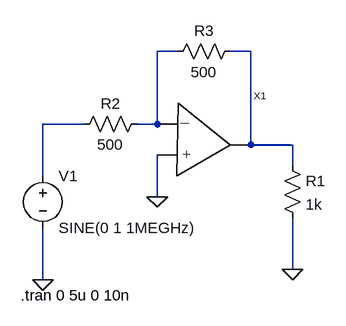
[diagram p0: schematic Inverting_Amplifier_V3.asc]
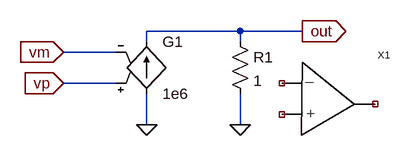
[diagram p1: sub-circuit opamp.asc]
Inverting_Amplifier_V3.asc, the LTspice schematic file:
Version 4
SHEET 1 880 680
WIRE 192 0 160 0
WIRE 304 0 272 0
WIRE 48 112 -16 112
WIRE 160 112 160 0
WIRE 160 112 128 112
WIRE 304 144 304 0
WIRE 368 144 304 144
WIRE 368 176 368 144
WIRE -16 192 -16 112
WIRE 160 224 160 160
WIRE 368 336 368 256
WIRE -16 352 -16 272
FLAG 368 336 0
FLAG 160 224 0
FLAG -16 352 0
SYMBOL opamp 192 144 R0
SYMATTR InstName X1
SYMBOL res 352 160 R0
SYMATTR InstName R1
SYMATTR Value 1k
SYMBOL voltage -16 176 R0
WINDOW 123 0 0 Left 0
WINDOW 39 0 0 Left 0
SYMATTR InstName V1
SYMATTR Value SINE(0 1 1MEGHz)
SYMBOL res 144 96 R90
WINDOW 0 0 56 VBottom 2
WINDOW 3 32 56 VTop 2
SYMATTR InstName R2
SYMATTR Value 500
SYMBOL res 288 -16 R90
WINDOW 0 0 56 VBottom 2
WINDOW 3 32 56 VTop 2
SYMATTR InstName R3
SYMATTR Value 500
TEXT -50 376 Left 2 !.tran 0 5u 0 10n

opamp.asc, the sub-circuit schematic file:
Version 4
SHEET 1 880 680
WIRE 336 112 192 112
WIRE 432 112 336 112
WIRE 192 128 192 112
WIRE 336 128 336 112
WIRE 144 144 64 144
WIRE 144 192 64 192
WIRE 192 256 192 208
WIRE 336 256 336 208
FLAG 192 256 0
FLAG 336 256 0
FLAG 64 144 vm
IOPIN 64 144 In
FLAG 64 192 vp
IOPIN 64 192 In
FLAG 432 112 out
IOPIN 432 112 Out
SYMBOL g2 192 112 R0
SYMATTR InstName G1
SYMATTR Value 1e6
SYMBOL res 320 112 R0
SYMATTR InstName R1
SYMATTR Value 1
SYMBOL opamp 432 224 R0
SYMATTR InstName X1

The netlist it stands for:
* Inverting_Amplifier_V3.asc
XX1 N001 0 N002 opamp
R1 N002 0 1k
V1 N003 0 SINE(0 1 1MEGHz)
R2 N001 N003 500
R3 N002 N001 500

* block symbol definitions
.subckt opamp vm vp out
G1 0 out vp vm 1e6
R1 out 0 1
XX1 NC_01 NC_02 NC_03 opamp
.ends opamp

.tran 0 5u 0 10n
.backanno
.end